# Altium schematic sheet waku-ctl.SchDoc (part 4 of 4)
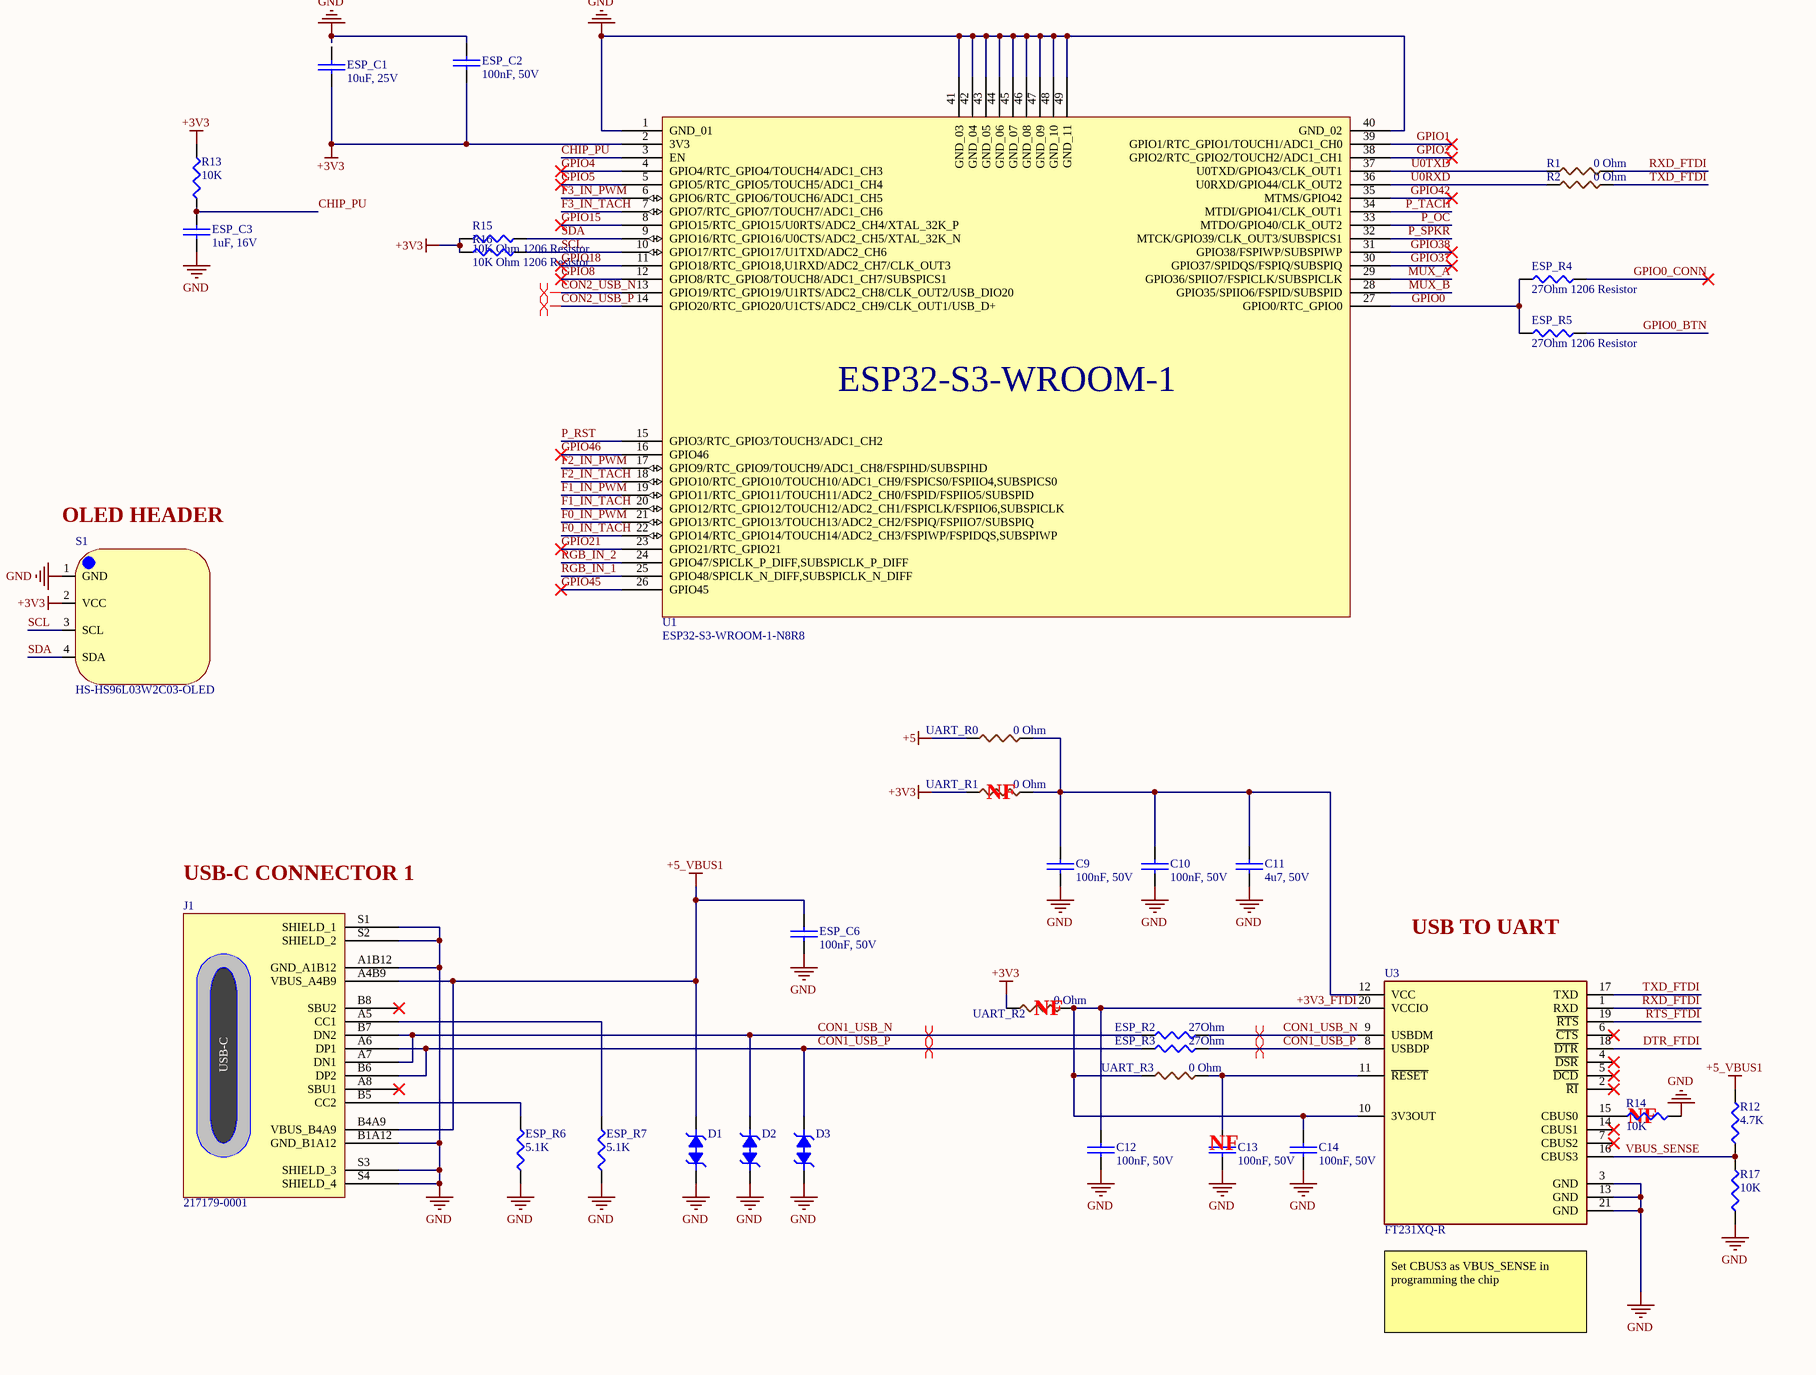
[diagram p6: waku-ctl.SchDoc, bottom right]

## Library data of the parts (continued)
U2 = TL1963A-33DCYR: IC REG LIN 3.3V 1.5A SOT-223-4; Manufacturer: Texas Instruments; Manufacturer Lifecycle Status: ACTIVE; Accuracy: 3%; Dropout Voltage: 340mV; Input Bias Current: 1mA; Max Supply Voltage: 20V; Min Current Limit: 1.6A; Min Input Voltage: 2.1V; Number of Outputs: 1; Output Type: Fixed; Polarity: Positive; Supplier: DigiKey; Supplier Part Number: 296-24897-1-ND; Manufacturer Part Number: TL1963A-33DCYR; RoHS: Compliant; Category: LDO Voltage Regulators; Stock: 5375; Pricing: 1=3.13, 10=2.344, 25=2.1476, 100=1.9323, 250=1.82956, 500=1.76766, 1000=1.71669 (USD); Case/Package: SOT-223; Contact Plating: Tin; Height: 1.8mm; Lead Free: Lead Free; Length: 6.5mm; Lifecycle Status: Production; Max Operating Temperature: 125°C; Max Output current: 1.5A; Max Output Voltage: 3.3V; Min Operating Temperature: -40°C; Min Output Voltage: 3.3V; Nominal Output Voltage: 3.3V; Pins: 4; Number of Regulators: 1; Output Current: 1.5A; Output Voltage: 3.3V; Quiescent Current: 1mA; Radiation Hardening: No; REACH SVHC: No; Schedule B: 8542390000, 8542390000|8542390000|8542390000|8542390000|8542390000; Thickness: 1.6mm; Width: 3.5mm; ComponentLink1URL: https://datasheet.octopart.com:443/TL1963A-33DCYR-Texas-Instruments-datasheet-36835243.pdf?src-supplier=Texas+Instruments; ComponentLink1Description: https://datasheet.octopart.com:443/TL1963A-33DCYR-Texas-Instruments-datasheet-36835243.pdf?src-supplier=Texas+Instruments; ComponentLink2URL: https://octopart.com:443/opatz8j6/c1?t=_hjM26srJTXimlWoz0hwPmhPShOdWqTTtZlxgPl76YIpI1e1lfOz6vFK3g9fy8jCwZdjRD39bKFl-SwUtt_X2elGu_a5JyIUi3ab4jqFwEdIcyGCqZDuCLNIP_w3GIZJ3P8n--D5b1rjIWS7LXwM19STenXNZbu8p0KFA8W7oBQV_ivRudpmZT50mMX2Vp98314N_6rp1Q36UB5gvpMsO63PTK3-vNOMGMPut6fT06y9PbrxSSFyecCsjNz6UlCyiFpcw-0KU9-TlLviTiFtZ9ayjlXBaBFlI8Jpt0Bt73Yqu16_MFihcf6dJVjVpyanKPDUZcqeEH_eZkGEYIRopIdqDftcfwP1SsajeGZNSMlrkFfMF6GGJRK0ej6tF3tO9HLN2g&src-supplier=Texas+Instruments; ComponentLink2Description: https://octopart.com:443/opatz8j6/c1?t=_hjM26srJTXimlWoz0hwPmhPShOdWqTTtZlxgPl76YIpI1e1lfOz6vFK3g9fy8jCwZdjRD39bKFl-SwUtt_X2elGu_a5JyIUi3ab4jqFwEdIcyGCqZDuCLNIP_w3GIZJ3P8n--D5b1rjIWS7LXwM19STenXNZbu8p0KFA8W7oBQV_ivRudpmZT50mMX2Vp98314N_6rp1Q36UB5gvpMsO63PTK3-vNOMGMPut6fT06y9PbrxSSFyecCsjNz6UlCyiFpcw-0KU9-TlLviTiFtZ9ayjlXBaBFlI8Jpt0Bt73Yqu16_MFihcf6dJVjVpyanKPDUZcqeEH_eZkGEYIRopIdqDftcfwP1SsajeGZNSMlrkFfMF6GGJRK0ej6tF3tO9HLN2g&src-supplier=Texas+Instruments; ComponentLink3URL: https://datasheet.octopart.com:443/TL1963A-33DCYR-Texas-Instruments-datasheet-10255270.pdf?src-supplier=Texas+Instruments; ComponentLink3Description: https://datasheet.octopart.com:443/TL1963A-33DCYR-Texas-Instruments-datasheet-10255270.pdf?src-supplier=Texas+Instruments; ComponentLink4URL: https://sigma.octopart.com:443/49253063/technical_drawing/Texas-Instruments-TL1963A-33DCYR.pdf?src-supplier=Texas+Instruments; ComponentLink4Description: https://sigma.octopart.com:443/49253063/technical_drawing/Texas-Instruments-TL1963A-33DCYR.pdf?src-supplier=Texas+Instruments; ComponentLink5URL: https://datasheet.octopart.com:443/TL1963A-33DCYR-Texas-Instruments-datasheet-159117591.pdf?src-supplier=Augswan; ComponentLink5Description: https://datasheet.octopart.com:443/TL1963A-33DCYR-Texas-Instruments-datasheet-159117591.pdf?src-supplier=Augswan; ComponentLink6URL: https://datasheet.octopart.com:443/TL1963A-33DCYR-Texas-Instruments-datasheet-21820479.pdf?src-supplier=Newark; ComponentLink6Description: https://datasheet.octopart.com:443/TL1963A-33DCYR-Texas-Instruments-datasheet-21820479.pdf?src-supplier=Newark; ComponentLink7URL: https://datasheet.octopart.com:443/TL1963A-33DCYR-Texas-Instruments-datasheet-16079880.pdf?src-supplier=Farnell; ComponentLink7Description: https://datasheet.octopart.com:443/TL1963A-33DCYR-Texas-Instruments-datasheet-16079880.pdf?src-supplier=Farnell; ComponentLink8URL: https://datasheet.octopart.com:443/TL1963A-33DCYR-Texas-Instruments-datasheet-14171511.pdf?src-supplier=iiiC; ComponentLink8Description: https://datasheet.octopart.com:443/TL1963A-33DCYR-Texas-Instruments-datasheet-14171511.pdf?src-supplier=iiiC; ComponentLink9URL: http://sigma.octopart.com:80/conflict_mineral_statement/Texas-Instruments-company-63.pdf?src-supplier=Compliance+Statements; ComponentLink9Description: http://sigma.octopart.com:80/conflict_mineral_statement/Texas-Instruments-company-63.pdf?src-supplier=Compliance+Statements; ComponentLink10URL: http://sigma.octopart.com:80/reach_statement/Texas-Instruments-company-64.pdf?src-supplier=Compliance+Statements; ComponentLink10Description: http://sigma.octopart.com:80/reach_statement/Texas-Instruments-company-64.pdf?src-supplier=Compliance+Statements; LCSC Part Number: C181262
U3 = FT231XQ-R: IC USB SERIAL FULL UART 20QFN; Manufacturer: FTDI; Data Rate: 12Mbps; Interface: UART, USB; Clock Frequency: 12.02MHz; Max Supply Current: 8.4mA; Max Supply Voltage: 5.5V; Min Supply Voltage: 2.97V; Number of Channels: 1; Operating Supply Current: 8mA; Operating Supply Voltage: 5V; Supplier: DigiKey; Supplier Part Number: 768-1128-6-ND; Manufacturer Part Number: FT231XQ-R; RoHS: Compliant; Category: Interface ICs; Pricing: 1=2.34, 25=2.27, 100=2.2, 250=2, 500=1.82002, 1000=1.7625 (USD); Ambient Temperature Range High: 85°C; Case/Package: QFN; Height: 800µm; Height - Seated (Max): 800µm; Lead Free: Lead Free; Length: 4mm; Lifecycle Status: Production; Max Operating Temperature: 85°C; Min Operating Temperature: -40°C; Mounting Technology: Surface Mount; Pins: 20; Number of Terminals: 20; REACH SVHC: Yes; Terminal Pitch: 500µm; Weight: 123.008581mg; Width: 4mm; ComponentLink1URL: https://datasheet.octopart.com:443/FT231XQ-R-FTDI-datasheet-182343132.pdf?src-supplier=IHS; ComponentLink1Description: https://datasheet.octopart.com:443/FT231XQ-R-FTDI-datasheet-182343132.pdf?src-supplier=IHS; ComponentLink2URL: https://datasheet.octopart.com:443/FT231XQ-R-FTDI-datasheet-11021087.pdf?src-supplier=ODG+(Origin+Data+Global); ComponentLink2Description: https://datasheet.octopart.com:443/FT231XQ-R-FTDI-datasheet-11021087.pdf?src-supplier=ODG+(Origin+Data+Global); ComponentLink3URL: https://datasheet.octopart.com:443/FT231XQ-R-FTDI-datasheet-28834672.pdf?src-supplier=SOS+electronic; ComponentLink3Description: https://datasheet.octopart.com:443/FT231XQ-R-FTDI-datasheet-28834672.pdf?src-supplier=SOS+electronic; ComponentLink4URL: https://datasheet.octopart.com:443/FT231XQ-R-FTDI-datasheet-68321328.pdf?src-supplier=TME; ComponentLink4Description: https://datasheet.octopart.com:443/FT231XQ-R-FTDI-datasheet-68321328.pdf?src-supplier=TME; ComponentLink5URL: https://datasheet.octopart.com:443/FT231XQ-R-FTDI-datasheet-134530624.pdf?src-supplier=SHENGYU+ELECTRONICS; ComponentLink5Description: https://datasheet.octopart.com:443/FT231XQ-R-FTDI-datasheet-134530624.pdf?src-supplier=SHENGYU+ELECTRONICS; LCSC Part Number: C132159
U4 = TXS0102DCTT: IC XLTR VL BIDIR SM8; Manufacturer: Texas Instruments; Manufacturer Lifecycle Status: ACTIVE; Data Rate: 24Mbps; High Level Output Current: -20µA; Logic Function: Translator; Low Level Output Current: 1mA; Max Supply Voltage: 5.5V; Min Supply Voltage: 1.65V; Number of Bits: 2; Output Type: Voltage; Propagation Delay: 260ns; Quiescent Current: 14.4µA; Supplier: DigiKey; Supplier Part Number: 296-32603-1-ND; Manufacturer Part Number: TXS0102DCTT; RoHS: Compliant; Category: Voltage Level Shifters; Stock: 2646; Pricing: 1=0.84, 10=0.607, 25=0.84, 100=0.4823 (EUR); Case/Package: SSOP; Contact Plating: Gold; Height: 1.3mm; Lead Free: Lead Free; Length: 2.95mm; Lifecycle Status: Production; Max Operating Temperature: 85°C; Min Operating Temperature: -40°C; Mounting Technology: Surface Mount; Number of Channels: 2; Number of Inputs: 2; Pins: 8; Output Current: 1mA; Radiation Hardening: No; REACH SVHC: No; Schedule B: 8542390000, 8542390000|8542390000|8542390000|8542390000|8542390000; Thickness: 1.29mm; Turn-On Delay Time: 260ns; Weight: 23.388357mg; Width: 2.8mm; ComponentLink1URL: https://sigma.octopart.com:443/154719557/technical_drawing/Texas-Instruments-TXS0102DCTT.pdf?src-supplier=Texas+Instruments; ComponentLink1Description: https://sigma.octopart.com:443/154719557/technical_drawing/Texas-Instruments-TXS0102DCTT.pdf?src-supplier=Texas+Instruments; ComponentLink2URL: https://octopart.com:443/opatz8j6/c1?t=E4R2Eaax4hVGdPeEVzJ4gkUh3nnsrHoOour21Zl2PzEYQ-bKun46UuTQmN5SmJNlHr2MN0dygUqsw7JioWoTKuAP2BHlSCWFo-TjZUaVeYrSnVZSGJ_Glnf5uw4q0S6o2BkL99zqCVR0l2toQcRu2hlwiNrHpc73CtYInpQ0G1iz-OsDFe77UTdj8dJ9JwwwMiYUwKp_DG-WfXRvHH-QIAYHoJT9FgpgXX1jlsZKiKvyrZCAYOvzmIO2K3-CyjjScMw3aD6_lreNJ_QqZ2GdBB_uljh_fBrzAX2zCbBRQ0CW3Cau6P5nyAI7VRUU2nDdhc-R337O6QHcHx2uPNu4SHtWdfIOwX_Lvr4jn97D1Z4g5KJ7FXfMjY26Xmd_V9c1RYRwqA&src-supplier=Texas+Instruments; ComponentLink2Description: https://octopart.com:443/opatz8j6/c1?t=E4R2Eaax4hVGdPeEVzJ4gkUh3nnsrHoOour21Zl2PzEYQ-bKun46UuTQmN5SmJNlHr2MN0dygUqsw7JioWoTKuAP2BHlSCWFo-TjZUaVeYrSnVZSGJ_Glnf5uw4q0S6o2BkL99zqCVR0l2toQcRu2hlwiNrHpc73CtYInpQ0G1iz-OsDFe77UTdj8dJ9JwwwMiYUwKp_DG-WfXRvHH-QIAYHoJT9FgpgXX1jlsZKiKvyrZCAYOvzmIO2K3-CyjjScMw3aD6_lreNJ_QqZ2GdBB_uljh_fBrzAX2zCbBRQ0CW3Cau6P5nyAI7VRUU2nDdhc-R337O6QHcHx2uPNu4SHtWdfIOwX_Lvr4jn97D1Z4g5KJ7FXfMjY26Xmd_V9c1RYRwqA&src-supplier=Texas+Instruments; ComponentLink3URL: https://datasheet.octopart.com:443/TXS0102DCTT-Texas-Instruments-datasheet-41205338.pdf?src-supplier=Texas+Instruments; ComponentLink3Description: https://datasheet.octopart.com:443/TXS0102DCTT-Texas-Instruments-datasheet-41205338.pdf?src-supplier=Texas+Instruments; ComponentLink4URL: https://datasheet.octopart.com:443/TXS0102DCTT-Texas-Instruments-datasheet-32869024.pdf?src-supplier=Texas+Instruments; ComponentLink4Description: https://datasheet.octopart.com:443/TXS0102DCTT-Texas-Instruments-datasheet-32869024.pdf?src-supplier=Texas+Instruments; ComponentLink5URL: https://datasheet.octopart.com:443/TXS0102DCTT-Texas-Instruments-datasheet-10257580.pdf?src-supplier=Texas+Instruments; ComponentLink5Description: https://datasheet.octopart.com:443/TXS0102DCTT-Texas-Instruments-datasheet-10257580.pdf?src-supplier=Texas+Instruments; ComponentLink6URL: https://sigma.octopart.com:443/49249897/technical_drawing/Texas-Instruments-TXS0102DCTT.pdf?src-supplier=Texas+Instruments; ComponentLink6Description: https://sigma.octopart.com:443/49249897/technical_drawing/Texas-Instruments-TXS0102DCTT.pdf?src-supplier=Texas+Instruments; ComponentLink7URL: https://datasheet.octopart.com:443/TXS0102DCTT-Texas-Instruments-datasheet-33026335.pdf?src-supplier=Newark; ComponentLink7Description: https://datasheet.octopart.com:443/TXS0102DCTT-Texas-Instruments-datasheet-33026335.pdf?src-supplier=Newark; ComponentLink8URL: https://datasheet.octopart.com:443/TXS0102DCTT-Texas-Instruments-datasheet-32038250.pdf?src-supplier=Newark; ComponentLink8Description: https://datasheet.octopart.com:443/TXS0102DCTT-Texas-Instruments-datasheet-32038250.pdf?src-supplier=Newark; ComponentLink9URL: https://datasheet.octopart.com:443/TXS0102DCTT-Texas-Instruments-datasheet-33012940.pdf?src-supplier=Newark; ComponentLink9Description: https://datasheet.octopart.com:443/TXS0102DCTT-Texas-Instruments-datasheet-33012940.pdf?src-supplier=Newark; ComponentLink10URL: https://datasheet.octopart.com:443/TXS0102DCTT-Texas-Instruments-datasheet-101363803.pdf?src-supplier=Farnell; ComponentLink10Description: https://datasheet.octopart.com:443/TXS0102DCTT-Texas-Instruments-datasheet-101363803.pdf?src-supplier=Farnell; ComponentLink11URL: https://datasheet.octopart.com:443/TXS0102DCTT-Texas-Instruments-datasheet-10911753.pdf?src-supplier=Farnell; ComponentLink11Description: https://datasheet.octopart.com:443/TXS0102DCTT-Texas-Instruments-datasheet-10911753.pdf?src-supplier=Farnell; ComponentLink12URL: https://datasheet.octopart.com:443/TXS0102DCTT-Texas-Instruments-datasheet-12517898.pdf?src-supplier=Farnell; ComponentLink12Description: https://datasheet.octopart.com:443/TXS0102DCTT-Texas-Instruments-datasheet-12517898.pdf?src-supplier=Farnell; ComponentLink13URL: https://datasheet.octopart.com:443/TXS0102DCTT-Texas-Instruments-datasheet-62116161.pdf?src-supplier=element14+APAC; ComponentLink13Description: https://datasheet.octopart.com:443/TXS0102DCTT-Texas-Instruments-datasheet-62116161.pdf?src-supplier=element14+APAC; ComponentLink14URL: https://datasheet.octopart.com:443/TXS0102DCTT-Texas-Instruments-datasheet-168584740.pdf?src-supplier=LCSC; ComponentLink14Description: https://datasheet.octopart.com:443/TXS0102DCTT-Texas-Instruments-datasheet-168584740.pdf?src-supplier=LCSC; ComponentLink15URL: https://datasheet.octopart.com:443/TXS0102DCTT-Texas-Instruments-datasheet-159598263.pdf?src-supplier=LCSC; ComponentLink15Description: https://datasheet.octopart.com:443/TXS0102DCTT-Texas-Instruments-datasheet-159598263.pdf?src-supplier=LCSC; ComponentLink16URL: https://datasheet.octopart.com:443/TXS0102DCTT-Texas-Instruments-datasheet-159118388.pdf?src-supplier=LCSC; ComponentLink16Description: https://datasheet.octopart.com:443/TXS0102DCTT-Texas-Instruments-datasheet-159118388.pdf?src-supplier=LCSC; ComponentLink17URL: https://datasheet.octopart.com:443/TXS0102DCTT-Texas-Instruments-datasheet-164421213.pdf?src-supplier=SHENGYU+ELECTRONICS; ComponentLink17Description: https://datasheet.octopart.com:443/TXS0102DCTT-Texas-Instruments-datasheet-164421213.pdf?src-supplier=SHENGYU+ELECTRONICS; ComponentLink18URL: https://datasheet.octopart.com:443/TXS0102DCTT-Texas-Instruments-datasheet-8482820.pdf?src-supplier=element14; ComponentLink18Description: https://datasheet.octopart.com:443/TXS0102DCTT-Texas-Instruments-datasheet-8482820.pdf?src-supplier=element14; ComponentLink19URL: https://datasheet.octopart.com:443/TXS0102DCTT-Texas-Instruments-datasheet-7564122.pdf?src-supplier=element14; ComponentLink19Description: https://datasheet.octopart.com:443/TXS0102DCTT-Texas-Instruments-datasheet-7564122.pdf?src-supplier=element14; ComponentLink20URL: http://sigma.octopart.com:80/conflict_mineral_statement/Texas-Instruments-company-63.pdf?src-supplier=Compliance+Statements; ComponentLink20Description: http://sigma.octopart.com:80/conflict_mineral_statement/Texas-Instruments-company-63.pdf?src-supplier=Compliance+Statements; ComponentLink21URL: http://sigma.octopart.com:80/reach_statement/Texas-Instruments-company-64.pdf?src-supplier=Compliance+Statements; ComponentLink21Description: http://sigma.octopart.com:80/reach_statement/Texas-Instruments-company-64.pdf?src-supplier=Compliance+Statements
U5 = CD4053BPWR: IC SWITCH SPDTX3 240OHM 16TSSOP; Manufacturer: Texas Instruments; Manufacturer Lifecycle Status: ACTIVE; -3db Bandwidth: 30MHz; Drain to Source Resistance: 240Ω; Logic Function: Demultiplexer, Multiplexer; Max Dual Supply Voltage: 9V; Max Junction Temperature (Tj): 150°C; Max Supply Voltage: 20V; Min Dual Supply Voltage: 2.5V; Min Supply Voltage: 3V; Nominal Supply Current: 100mA; Number of Channels: 3; Number of Inputs: 6; Operating Supply Current: 80nA; Operating Supply Voltage: 18V; Polarity: Non-Inverting; Propagation Delay: 60ns; Supply Type: Dual, Single; Throw Configuration: SPDT; Turn-Off Delay Time: 450ns; Turn-On Delay Time: 720ns; Supplier: DigiKey; Supplier Part Number: 296-14117-1-ND; Manufacturer Part Number: CD4053BPWR; RoHS: Compliant; Category: Analog Switches and Multiplexers; Stock: 15637; Pricing: 1=0.4, 10=0.279, 25=0.4, 100=0.2158, 250=0.20008, 500=0.19064, 1000=0.18387 (EUR); Bandwidth: 30MHz; Case/Package: TSSOP; Contact Plating: Gold; Height: 1.2mm; Lead Free: Lead Free; Length: 5mm; Lifecycle Status: Production; Max Operating Temperature: 125°C; Min Operating Temperature: -55°C; Mounting Technology: Surface Mount; Number of Circuits: 3; Number of Outputs: 3; Pins: 16; Quiescent Current: 80nA; Radiation Hardening: No; REACH SVHC: No; Schedule B: 8542390000, 8542390000|8542390000|8542390000|8542390000|8542390000; Thickness: 1mm; Weight: 61.887009mg; Width: 4.4mm; ComponentLink1URL: https://sigma.octopart.com:443/189718192/technical_drawing/Texas-Instruments-CD4053BPWR.pdf?src-supplier=Texas+Instruments; ComponentLink1Description: https://sigma.octopart.com:443/189718192/technical_drawing/Texas-Instruments-CD4053BPWR.pdf?src-supplier=Texas+Instruments; ComponentLink2URL: https://octopart.com:443/opatz8j6/c1?t=6R177RNltDDYCh6H-w-zTHHvFkHrLVQKh39Qzd_HrvBNvmgdCy5qEsa0mfpVmcm5eyJbdfKCSdH7omhCWuoM6w1RRAvuj0OocnPPs95VfrjsXd3CD812-zfDELyDev5ZC0rWSeR1RMtH-_lmJASLqs4qp0xwLDVc3wr1-mE5ko46Ghs0h3kbkhjVzWusulVM26V4iFdpPmO0_yeYc9d8IT4KpSupE-hBY9tb1NrRv5FO8G4JSQQMlv7pjHh6IBWZ9ijQztKqb0f-Vr5oaI3G6EqxBUTLk2-CyfgYc1HO3XQWXmkR9lMlBS2nfZno2dKj6l49JO1XXE7ZlRETAECyeErUfOtYG8ZZHOC1pQp4e2jeicqkqwy8Z8V4YsapmS_nTYRF&src-supplier=Texas+Instruments; ComponentLink2Description: https://octopart.com:443/opatz8j6/c1?t=6R177RNltDDYCh6H-w-zTHHvFkHrLVQKh39Qzd_HrvBNvmgdCy5qEsa0mfpVmcm5eyJbdfKCSdH7omhCWuoM6w1RRAvuj0OocnPPs95VfrjsXd3CD812-zfDELyDev5ZC0rWSeR1RMtH-_lmJASLqs4qp0xwLDVc3wr1-mE5ko46Ghs0h3kbkhjVzWusulVM26V4iFdpPmO0_yeYc9d8IT4KpSupE-hBY9tb1NrRv5FO8G4JSQQMlv7pjHh6IBWZ9ijQztKqb0f-Vr5oaI3G6EqxBUTLk2-CyfgYc1HO3XQWXmkR9lMlBS2nfZno2dKj6l49JO1XXE7ZlRETAECyeErUfOtYG8ZZHOC1pQp4e2jeicqkqwy8Z8V4YsapmS_nTYRF&src-supplier=Texas+Instruments; ComponentLink3URL: https://sigma.octopart.com:443/116621398/technical_drawing/Texas-Instruments-CD4053BPWR.pdf?src-supplier=Texas+Instruments; ComponentLink3Description: https://sigma.octopart.com:443/116621398/technical_drawing/Texas-Instruments-CD4053BPWR.pdf?src-supplier=Texas+Instruments; ComponentLink4URL: https://datasheet.octopart.com:443/CD4053BPWR-Texas-Instruments-datasheet-10253597.pdf?src-supplier=Texas+Instruments; ComponentLink4Description: https://datasheet.octopart.com:443/CD4053BPWR-Texas-Instruments-datasheet-10253597.pdf?src-supplier=Texas+Instruments; ComponentLink5URL: https://sigma.octopart.com:443/49249815/technical_drawing/Texas-Instruments-CD4053BPWR.pdf?src-supplier=Texas+Instruments; ComponentLink5Description: https://sigma.octopart.com:443/49249815/technical_drawing/Texas-Instruments-CD4053BPWR.pdf?src-supplier=Texas+Instruments; ComponentLink6URL: https://datasheet.octopart.com:443/CD4053BPWR-Texas-Instruments-datasheet-148785.pdf?src-supplier=Mouser; ComponentLink6Description: https://datasheet.octopart.com:443/CD4053BPWR-Texas-Instruments-datasheet-148785.pdf?src-supplier=Mouser; ComponentLink7URL: https://datasheet.octopart.com:443/CD4053BPWR-Texas-Instruments-datasheet-154276024.pdf?src-supplier=Upverter; ComponentLink7Description: https://datasheet.octopart.com:443/CD4053BPWR-Texas-Instruments-datasheet-154276024.pdf?src-supplier=Upverter; ComponentLink8URL: https://datasheet.octopart.com:443/CD4053BPWR-Texas-Instruments-datasheet-62345999.pdf?src-supplier=Newark; ComponentLink8Description: https://datasheet.octopart.com:443/CD4053BPWR-Texas-Instruments-datasheet-62345999.pdf?src-supplier=Newark; ComponentLink9URL: https://datasheet.octopart.com:443/CD4053BPWR-Texas-Instruments-datasheet-10694235.pdf?src-supplier=Newark; ComponentLink9Description: https://datasheet.octopart.com:443/CD4053BPWR-Texas-Instruments-datasheet-10694235.pdf?src-supplier=Newark; ComponentLink10URL: https://datasheet.octopart.com:443/CD4053BPWR-Texas-Instruments-datasheet-17021337.pdf?src-supplier=element14+APAC; ComponentLink10Description: https://datasheet.octopart.com:443/CD4053BPWR-Texas-Instruments-datasheet-17021337.pdf?src-supplier=element14+APAC; ComponentLink11URL: https://datasheet.octopart.com:443/CD4053BPWR-Texas-Instruments-datasheet-62088664.pdf?src-supplier=element14+APAC; ComponentLink11Description: https://datasheet.octopart.com:443/CD4053BPWR-Texas-Instruments-datasheet-62088664.pdf?src-supplier=element14+APAC; ComponentLink12URL: https://datasheet.octopart.com:443/CD4053BPWR-Texas-Instruments-datasheet-37129006.pdf?src-supplier=Farnell; ComponentLink12Description: https://datasheet.octopart.com:443/CD4053BPWR-Texas-Instruments-datasheet-37129006.pdf?src-supplier=Farnell; ComponentLink13URL: https://datasheet.octopart.com:443/CD4053BPWR-Texas-Instruments-datasheet-32026515.pdf?src-supplier=Farnell; ComponentLink13Description: https://datasheet.octopart.com:443/CD4053BPWR-Texas-Instruments-datasheet-32026515.pdf?src-supplier=Farnell; ComponentLink14URL: https://datasheet.octopart.com:443/CD4053BPWR-Texas-Instruments-datasheet-165803805.pdf?src-supplier=LCSC; ComponentLink14Description: https://datasheet.octopart.com:443/CD4053BPWR-Texas-Instruments-datasheet-165803805.pdf?src-supplier=LCSC; ComponentLink15URL: https://datasheet.octopart.com:443/CD4053BPWR-Texas-Instruments-datasheet-159114769.pdf?src-supplier=LCSC; ComponentLink15Description: https://datasheet.octopart.com:443/CD4053BPWR-Texas-Instruments-datasheet-159114769.pdf?src-supplier=LCSC; ComponentLink16URL: https://datasheet.octopart.com:443/CD4053BPWR-Texas-Instruments-datasheet-148393487.pdf?src-supplier=SHENGYU+ELECTRONICS; ComponentLink16Description: https://datasheet.octopart.com:443/CD4053BPWR-Texas-Instruments-datasheet-148393487.pdf?src-supplier=SHENGYU+ELECTRONICS; ComponentLink17URL: https://datasheet.octopart.com:443/CD4053BPWR-Texas-Instruments-datasheet-14119637.pdf?src-supplier=iiiC; ComponentLink17Description: https://datasheet.octopart.com:443/CD4053BPWR-Texas-Instruments-datasheet-14119637.pdf?src-supplier=iiiC; ComponentLink18URL: https://datasheet.octopart.com:443/CD4053BPWR-Texas-Instruments-datasheet-11518364.pdf?src-supplier=Arrow+Electronics; ComponentLink18Description: https://datasheet.octopart.com:443/CD4053BPWR-Texas-Instruments-datasheet-11518364.pdf?src-supplier=Arrow+Electronics; ComponentLink19URL: https://datasheet.octopart.com:443/CD4053BPWR-Texas-Instruments-datasheet-8428635.pdf?src-supplier=Jameco; ComponentLink19Description: https://datasheet.octopart.com:443/CD4053BPWR-Texas-Instruments-datasheet-8428635.pdf?src-supplier=Jameco; ComponentLink20URL: https://datasheet.octopart.com:443/CD4053BPWR-Texas-Instruments-datasheet-42768.pdf?src-supplier=DigiKey; ComponentLink20Description: https://datasheet.octopart.com:443/CD4053BPWR-Texas-Instruments-datasheet-42768.pdf?src-supplier=DigiKey; ComponentLink21URL: http://sigma.octopart.com:80/conflict_mineral_statement/Texas-Instruments-company-63.pdf?src-supplier=Compliance+Statements; ComponentLink21Description: http://sigma.octopart.com:80/conflict_mineral_statement/Texas-Instruments-company-63.pdf?src-supplier=Compliance+Statements; ComponentLink22URL: http://sigma.octopart.com:80/reach_statement/Texas-Instruments-company-64.pdf?src-supplier=Compliance+Statements; ComponentLink22Description: http://sigma.octopart.com:80/reach_statement/Texas-Instruments-company-64.pdf?src-supplier=Compliance+Statements
U6 = ADS1115IDGSR: IC ADC 16BIT SIGMA-DELTA 10VSSOP; Manufacturer: Texas Instruments; Manufacturer Lifecycle Status: ACTIVE; Conversion Rate: 860sps; Integral Nonlinearity (INL): 1LSB; Interface: I2C; Max Junction Temperature (Tj): 150°C; Max Supply Voltage: 5.5V; Min Supply Voltage: 2V; Nominal Supply Current: 150µA; Number of A/D Converters: 1; Number of Bits: 16; Number of Channels: 2; Number of Inputs: 4; Polarity: Bipolar; Power Dissipation: 900µW; Resolution: 2B; Supply Type: Single; Supplier: DigiKey; Supplier Part Number: 296-38849-1-ND; Manufacturer Part Number: ADS1115IDGSR; RoHS: Compliant; Category: Analog to Digital Converters (ADCs); Stock: 9217; Pricing: 1=4.36, 10=3.329, 25=4.36, 100=2.785, 250=2.64912, 500=2.56724, 1000=2.49986 (EUR); Ambient Temperature Range High: 125°C; Case/Package: VSSOP; Contact Plating: Gold; Height: 1.07mm; Lead Free: Lead Free; Length: 3mm; Lifecycle Status: Production; Max Operating Temperature: 125°C; Max Supply Voltage (DC): 5.5V; Min Operating Temperature: -40°C; Min Supply Voltage (DC): 2V; Number of Converters: 1; Pins: 10; Radiation Hardening: No; REACH SVHC: No; Sampling Rate: 860sps; Schedule B: 8542390000, 8542390000|8542390000|8542390000|8542390000|8542390000; Thickness: 1.02mm; Width: 3mm; ComponentLink1URL: https://datasheet.octopart.com:443/ADS1115IDGSR-Texas-Instruments-datasheet-21818186.pdf?src-supplier=Newark; ComponentLink1Description: https://datasheet.octopart.com:443/ADS1115IDGSR-Texas-Instruments-datasheet-21818186.pdf?src-supplier=Newark; ComponentLink2URL: https://octopart.com:443/opatz8j6/c1?t=IuqcA-XNANVnUgh6bO5qed4pAqyN2BqXsIjLAySB2Hr-eHtD8pK9l6OOA6AGsTuVanxQmOkBsFQN-rlHciEN_k6CTJvcjzCJlSq-wVqGrNuiBwTkWy4ml0ROCJtQ1-lij77U2D_WoJ3znwfT0mMt9ikQ9I9gRMar-xW9CqMxsY2FjbMMvAysjMOkXQ1FlQyveQwqsSa6_aCP81y3rIEwyR4aAdYLYQAG9CvpdWj9_mOw_IWbI1A0mS4Nr3T47cwXgL4gd3vwJQBENC_vJJ1ljWY6eimCFVEfMSp8To8QyZoXqbl__zcnRO1ari-Z50yUygNu99GuoBJUHWWpTBL6cSd8XR7eVfe8TQCRE2bK5TYPZsJNK_jD7hLJEK0orzhEdbBg33g&src-supplier=Texas+Instruments; ComponentLink2Description: https://octopart.com:443/opatz8j6/c1?t=IuqcA-XNANVnUgh6bO5qed4pAqyN2BqXsIjLAySB2Hr-eHtD8pK9l6OOA6AGsTuVanxQmOkBsFQN-rlHciEN_k6CTJvcjzCJlSq-wVqGrNuiBwTkWy4ml0ROCJtQ1-lij77U2D_WoJ3znwfT0mMt9ikQ9I9gRMar-xW9CqMxsY2FjbMMvAysjMOkXQ1FlQyveQwqsSa6_aCP81y3rIEwyR4aAdYLYQAG9CvpdWj9_mOw_IWbI1A0mS4Nr3T47cwXgL4gd3vwJQBENC_vJJ1ljWY6eimCFVEfMSp8To8QyZoXqbl__zcnRO1ari-Z50yUygNu99GuoBJUHWWpTBL6cSd8XR7eVfe8TQCRE2bK5TYPZsJNK_jD7hLJEK0orzhEdbBg33g&src-supplier=Texas+Instruments; ComponentLink3URL: https://datasheet.octopart.com:443/ADS1115IDGSR-Texas-Instruments-datasheet-10254488.pdf?src-supplier=Texas+Instruments; ComponentLink3Description: https://datasheet.octopart.com:443/ADS1115IDGSR-Texas-Instruments-datasheet-10254488.pdf?src-supplier=Texas+Instruments; ComponentLink4URL: https://datasheet.octopart.com:443/ADS1115IDGSR-Texas-Instruments-datasheet-10258908.pdf?src-supplier=Texas+Instruments; ComponentLink4Description: https://datasheet.octopart.com:443/ADS1115IDGSR-Texas-Instruments-datasheet-10258908.pdf?src-supplier=Texas+Instruments; ComponentLink5URL: https://sigma.octopart.com:443/49250172/technical_drawing/Texas-Instruments-ADS1115IDGSR.pdf?src-supplier=Texas+Instruments; ComponentLink5Description: https://sigma.octopart.com:443/49250172/technical_drawing/Texas-Instruments-ADS1115IDGSR.pdf?src-supplier=Texas+Instruments; ComponentLink6URL: https://datasheet.octopart.com:443/ADS1115IDGSR-Texas-Instruments-datasheet-159114584.pdf?src-supplier=LCSC; ComponentLink6Description: https://datasheet.octopart.com:443/ADS1115IDGSR-Texas-Instruments-datasheet-159114584.pdf?src-supplier=LCSC; ComponentLink7URL: https://datasheet.octopart.com:443/ADS1115IDGSR-Texas-Instruments-datasheet-164412415.pdf?src-supplier=SHENGYU+ELECTRONICS; ComponentLink7Description: https://datasheet.octopart.com:443/ADS1115IDGSR-Texas-Instruments-datasheet-164412415.pdf?src-supplier=SHENGYU+ELECTRONICS; ComponentLink8URL: https://datasheet.octopart.com:443/ADS1115IDGSR-Texas-Instruments-datasheet-78774318.pdf?src-supplier=Farnell; ComponentLink8Description: https://datasheet.octopart.com:443/ADS1115IDGSR-Texas-Instruments-datasheet-78774318.pdf?src-supplier=Farnell; ComponentLink9URL: https://datasheet.octopart.com:443/ADS1115IDGSR-Texas-Instruments-datasheet-150582607.pdf?src-supplier=Arrow.cn; ComponentLink9Description: https://datasheet.octopart.com:443/ADS1115IDGSR-Texas-Instruments-datasheet-150582607.pdf?src-supplier=Arrow.cn; ComponentLink10URL: https://datasheet.octopart.com:443/ADS1115IDGSR-Texas-Instruments-datasheet-14070808.pdf?src-supplier=iiiC; ComponentLink10Description: https://datasheet.octopart.com:443/ADS1115IDGSR-Texas-Instruments-datasheet-14070808.pdf?src-supplier=iiiC; ComponentLink11URL: http://sigma.octopart.com:80/conflict_mineral_statement/Texas-Instruments-company-63.pdf?src-supplier=Compliance+Statements; ComponentLink11Description: http://sigma.octopart.com:80/conflict_mineral_statement/Texas-Instruments-company-63.pdf?src-supplier=Compliance+Statements; ComponentLink12URL: http://sigma.octopart.com:80/reach_statement/Texas-Instruments-company-64.pdf?src-supplier=Compliance+Statements; ComponentLink12Description: http://sigma.octopart.com:80/reach_statement/Texas-Instruments-company-64.pdf?src-supplier=Compliance+Statements
U7 = TXS0108EPWR: IC XLTR VL BIDIR 20-TSSOP; Manufacturer: Texas Instruments; Manufacturer Lifecycle Status: ACTIVE; Data Rate: 60Mbps; High Level Output Current: -50mA; Logic Function: Translator; Low Level Output Current: 50mA; Max Junction Temperature (Tj): 150°C; Max Supply Voltage: 5.5V; Min Supply Voltage: 1.4V; Nominal Supply Current: 3µA; Number of Bits: 8; Number of Circuits: 1; Output Current: 620µA; Output Type: Voltage; Propagation Delay: 112ns; Rise Time: 6.3ns; Turn-On Delay Time: 312ns; Supplier: DigiKey; Supplier Part Number: 296-23011-1-ND; Manufacturer Part Number: TXS0108EPWR; RoHS: Compliant; Category: Voltage Level Shifters; Stock: 26619; Pricing: 1=1.14, 1=1.34, 10=0.831, 10=0.975, 25=1.14, 25=0.8832, 100=0.6669, 100=0.7825, 250=0.626, 250=0.73448, 500=0.61028, 500=0.71604, 2000=0.6621, 4000=0.64596, 6000=0.63788, 10000=0.62892, 14000=0.62369 (EUR); Ambient Temperature Range High: 85°C; Case/Package: TSSOP; Contact Plating: Gold; Height: 0m; Lead Free: Lead Free; Length: 6.5mm; Lifecycle Status: Production; Max Operating Temperature: 85°C; Min Operating Temperature: -40°C; Mounting Technology: Surface Mount; Number of Channels: 8; Number of Inputs: 8; Number of Outputs: 8; Pins: 20; Packaging: Cut Tape; Quiescent Current: 3µA; Radiation Hardening: No; REACH SVHC: No; Schedule B: 8542390000, 8542390000|8542390000|8542390000|8542390000|8542390000; Termination: SMD/SMT; Thickness: 1mm; Weight: 76.997305mg; Width: 4.4mm; ComponentLink1URL: https://sigma.octopart.com:443/157851284/technical_drawing/Texas-Instruments-TXS0108EPWR.pdf?src-supplier=Texas+Instruments; ComponentLink1Description: https://sigma.octopart.com:443/157851284/technical_drawing/Texas-Instruments-TXS0108EPWR.pdf?src-supplier=Texas+Instruments; ComponentLink2URL: https://octopart.com:443/opatz8j6/c1?t=NPg61q9ydUF4fOuzs17YvdBnZXuMeR-2-6htKr1c5OrgHIe3g47f-94f21uk0kOql9r320ATDg6fPYZjx9SHo8no9-XVAdT5ts3zdlchslm2LZr6UrREW20h-GW4WvevFUKpPe6Qt1epEcD4IhvGHw1kIhR06hzCfWqD7ust2h4gb_a5mijVssLRkcVR7AQ2V2xOdQ09V2qIfv84C95KAiSjwkk4TqMP_i8BLYBReyAka2d4TmbjB2WXlL8kMRV6K2mYhKU_vOxxIPplVRP_hVDUPjIYBGIHxAotxO2oYNxSqSBcgp8VmgZXvEPVoT1zu5JVrrlUn-h2IFogxZuegGmbWNgsvF7HGBkk0pm-MBOM0ZnzxN-PH3mx8T5grJ5h4k0OBfI&src-supplier=Texas+Instruments; ComponentLink2Description: https://octopart.com:443/opatz8j6/c1?t=NPg61q9ydUF4fOuzs17YvdBnZXuMeR-2-6htKr1c5OrgHIe3g47f-94f21uk0kOql9r320ATDg6fPYZjx9SHo8no9-XVAdT5ts3zdlchslm2LZr6UrREW20h-GW4WvevFUKpPe6Qt1epEcD4IhvGHw1kIhR06hzCfWqD7ust2h4gb_a5mijVssLRkcVR7AQ2V2xOdQ09V2qIfv84C95KAiSjwkk4TqMP_i8BLYBReyAka2d4TmbjB2WXlL8kMRV6K2mYhKU_vOxxIPplVRP_hVDUPjIYBGIHxAotxO2oYNxSqSBcgp8VmgZXvEPVoT1zu5JVrrlUn-h2IFogxZuegGmbWNgsvF7HGBkk0pm-MBOM0ZnzxN-PH3mx8T5grJ5h4k0OBfI&src-supplier=Texas+Instruments; ComponentLink3URL: https://datasheet.octopart.com:443/TXS0108EPWR-Texas-Instruments-datasheet-10257968.pdf?src-supplier=Texas+Instruments; ComponentLink3Description: https://datasheet.octopart.com:443/TXS0108EPWR-Texas-Instruments-datasheet-10257968.pdf?src-supplier=Texas+Instruments; ComponentLink4URL: https://sigma.octopart.com:443/49249835/technical_drawing/Texas-Instruments-TXS0108EPWR.pdf?src-supplier=Texas+Instruments; ComponentLink4Description: https://sigma.octopart.com:443/49249835/technical_drawing/Texas-Instruments-TXS0108EPWR.pdf?src-supplier=Texas+Instruments; ComponentLink5URL: https://datasheet.octopart.com:443/TXS0108EPWR-Texas-Instruments-datasheet-34155243.pdf?src-supplier=element14+APAC; ComponentLink5Description: https://datasheet.octopart.com:443/TXS0108EPWR-Texas-Instruments-datasheet-34155243.pdf?src-supplier=element14+APAC; ComponentLink6URL: https://datasheet.octopart.com:443/TXS0108EPWR-Texas-Instruments-datasheet-101601150.pdf?src-supplier=element14+APAC; ComponentLink6Description: https://datasheet.octopart.com:443/TXS0108EPWR-Texas-Instruments-datasheet-101601150.pdf?src-supplier=element14+APAC; ComponentLink7URL: https://datasheet.octopart.com:443/TXS0108EPWR.-Texas-Instruments-datasheet-66618007.pdf?src-supplier=element14+APAC; ComponentLink7Description: https://datasheet.octopart.com:443/TXS0108EPWR.-Texas-Instruments-datasheet-66618007.pdf?src-supplier=element14+APAC; ComponentLink8URL: https://datasheet.octopart.com:443/TXS0108EPWR.-Texas-Instruments-datasheet-62089077.pdf?src-supplier=element14+APAC; ComponentLink8Description: https://datasheet.octopart.com:443/TXS0108EPWR.-Texas-Instruments-datasheet-62089077.pdf?src-supplier=element14+APAC; ComponentLink9URL: https://datasheet.octopart.com:443/TXS0108EPWR-Texas-Instruments-datasheet-21821524.pdf?src-supplier=element14+APAC; ComponentLink9Description: https://datasheet.octopart.com:443/TXS0108EPWR-Texas-Instruments-datasheet-21821524.pdf?src-supplier=element14+APAC; ComponentLink10URL: https://datasheet.octopart.com:443/TXS0108EPWR-Texas-Instruments-datasheet-157246788.pdf?src-supplier=ODG+(Origin+Data+Global); ComponentLink10Description: https://datasheet.octopart.com:443/TXS0108EPWR-Texas-Instruments-datasheet-157246788.pdf?src-supplier=ODG+(Origin+Data+Global); ComponentLink11URL: https://datasheet.octopart.com:443/TXS0108EPWR-Texas-Instruments-datasheet-15851133.pdf?src-supplier=Newark; ComponentLink11Description: https://datasheet.octopart.com:443/TXS0108EPWR-Texas-Instruments-datasheet-15851133.pdf?src-supplier=Newark; ComponentLink12URL: https://datasheet.octopart.com:443/TXS0108EPWR-Texas-Instruments-datasheet-25361057.pdf?src-supplier=Newark; ComponentLink12Description: https://datasheet.octopart.com:443/TXS0108EPWR-Texas-Instruments-datasheet-25361057.pdf?src-supplier=Newark; ComponentLink13URL: https://datasheet.octopart.com:443/TXS0108EPWR-Texas-Instruments-datasheet-159118391.pdf?src-supplier=LCSC; ComponentLink13Description: https://datasheet.octopart.com:443/TXS0108EPWR-Texas-Instruments-datasheet-159118391.pdf?src-supplier=LCSC; ComponentLink14URL: https://datasheet.octopart.com:443/TXS0108EPWR-Texas-Instruments-datasheet-104531687.pdf?src-supplier=TME; ComponentLink14Description: https://datasheet.octopart.com:443/TXS0108EPWR-Texas-Instruments-datasheet-104531687.pdf?src-supplier=TME; ComponentLink15URL: https://datasheet.octopart.com:443/TXS0108EPWR-Texas-Instruments-datasheet-140572054.pdf?src-supplier=Arrow.cn; ComponentLink15Description: https://datasheet.octopart.com:443/TXS0108EPWR-Texas-Instruments-datasheet-140572054.pdf?src-supplier=Arrow.cn; ComponentLink16URL: https://datasheet.octopart.com:443/TXS0108EPWR-Texas-Instruments-datasheet-137316104.pdf?src-supplier=Future+Electronics; ComponentLink16Description: https://datasheet.octopart.com:443/TXS0108EPWR-Texas-Instruments-datasheet-137316104.pdf?src-supplier=Future+Electronics; ComponentLink17URL: https://datasheet.octopart.com:443/TXS0108EPWR-Texas-Instruments-datasheet-14151909.pdf?src-supplier=iiiC; ComponentLink17Description: https://datasheet.octopart.com:443/TXS0108EPWR-Texas-Instruments-datasheet-14151909.pdf?src-supplier=iiiC; ComponentLink18URL: https://datasheet.octopart.com:443/TXS0108EPWR-Texas-Instruments-datasheet-11046612.pdf?src-supplier=Farnell; ComponentLink18Description: https://datasheet.octopart.com:443/TXS0108EPWR-Texas-Instruments-datasheet-11046612.pdf?src-supplier=Farnell; ComponentLink19URL: https://datasheet.octopart.com:443/TXS0108EPWR-Texas-Instruments-datasheet-5325602.pdf?src-supplier=Farnell; ComponentLink19Description: https://datasheet.octopart.com:443/TXS0108EPWR-Texas-Instruments-datasheet-5325602.pdf?src-supplier=Farnell; ComponentLink20URL: http://sigma.octopart.com:80/conflict_mineral_statement/Texas-Instruments-company-63.pdf?src-supplier=Compliance+Statements; ComponentLink20Description: http://sigma.octopart.com:80/conflict_mineral_statement/Texas-Instruments-company-63.pdf?src-supplier=Compliance+Statements; ComponentLink21URL: http://sigma.octopart.com:80/reach_statement/Texas-Instruments-company-64.pdf?src-supplier=Compliance+Statements; ComponentLink21Description: http://sigma.octopart.com:80/reach_statement/Texas-Instruments-company-64.pdf?src-supplier=Compliance+Statements